# Altium schematic sheet VREF_DAC.SchDoc
size OrCAD B; SheetNumber: 8; SheetTotal: 11
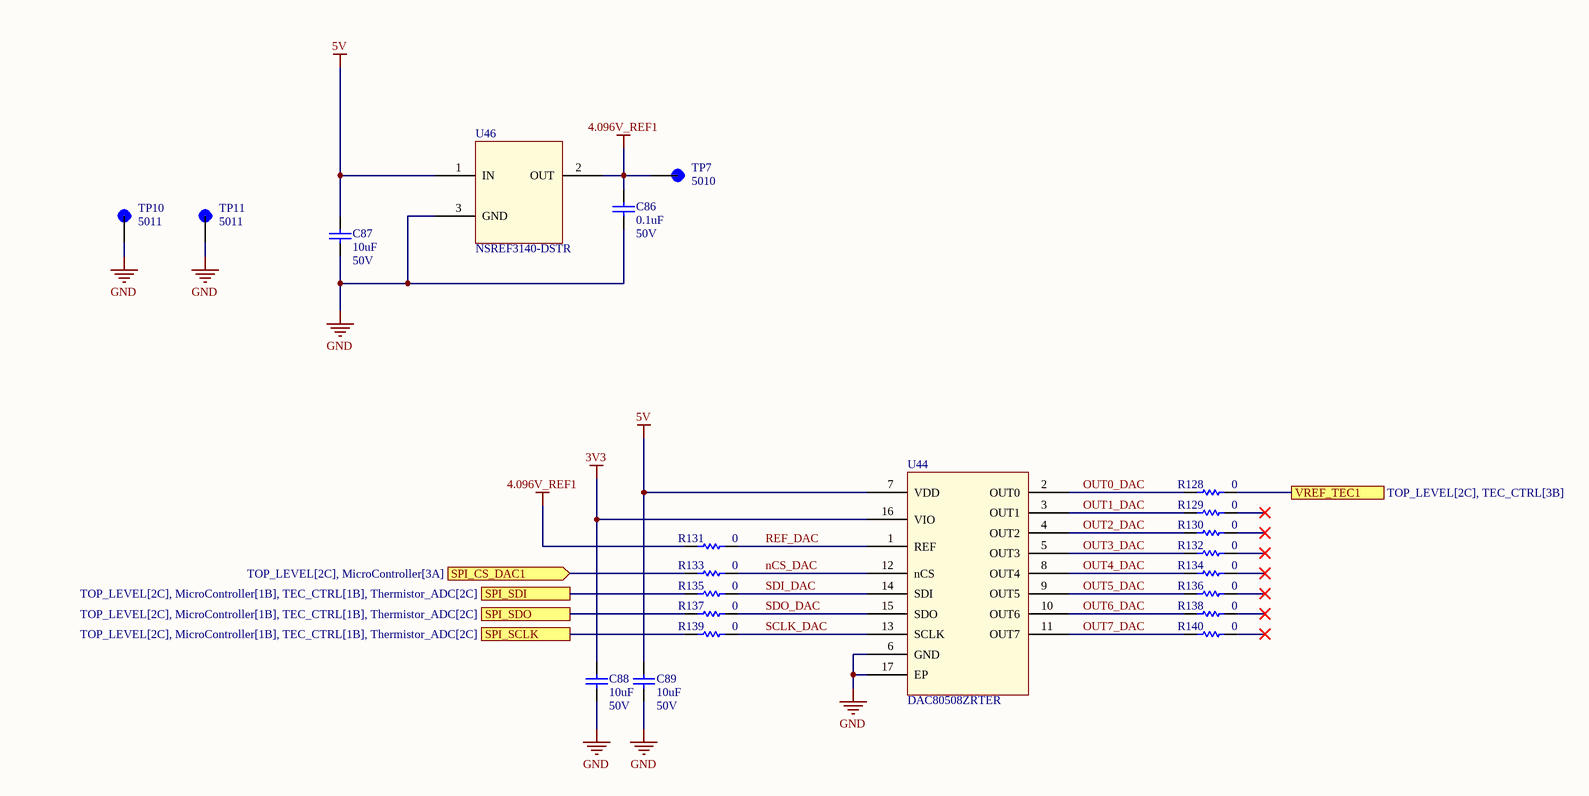
[diagram p0: VREF_DAC.SchDoc]

## Parts
C86  value 0.1uF  Rating: 50V  [DEFAULT_CAPACITOR_0805]  (hidden comment: KGM21NR71H104KT)
C87  value 10uF  Rating: 50V  [DEFAULT_CAPACITOR_0805]  (hidden comment: GRM21BR61H106KE43L)
C88  value 10uF  Rating: 50V  [DEFAULT_CAPACITOR_0805]  (hidden comment: GRM21BR61H106KE43L)
C89  value 10uF  Rating: 50V  [DEFAULT_CAPACITOR_0805]  (hidden comment: GRM21BR61H106KE43L)
R128  value 0  [DEFAULT_RESISTOR_0805]  (hidden comment: RC0805JR-070RL)
R129  value 0  [DEFAULT_RESISTOR_0805]  (hidden comment: RC0805JR-070RL)
R130  value 0  [DEFAULT_RESISTOR_0805]  (hidden comment: RC0805JR-070RL)
R131  value 0  [DEFAULT_RESISTOR_0805]  (hidden comment: RC0805JR-070RL)
R132  value 0  [DEFAULT_RESISTOR_0805]  (hidden comment: RC0805JR-070RL)
R133  value 0  [DEFAULT_RESISTOR_0805]  (hidden comment: RC0805JR-070RL)
R134  value 0  [DEFAULT_RESISTOR_0805]  (hidden comment: RC0805JR-070RL)
R135  value 0  [DEFAULT_RESISTOR_0805]  (hidden comment: RC0805JR-070RL)
R136  value 0  [DEFAULT_RESISTOR_0805]  (hidden comment: RC0805JR-070RL)
R137  value 0  [DEFAULT_RESISTOR_0805]  (hidden comment: RC0805JR-070RL)
R138  value 0  [DEFAULT_RESISTOR_0805]  (hidden comment: RC0805JR-070RL)
R139  value 0  [DEFAULT_RESISTOR_0805]  (hidden comment: RC0805JR-070RL)
R140  value 0  [DEFAULT_RESISTOR_0805]  (hidden comment: RC0805JR-070RL)
TP7  5010  [TP_5011]
TP10  5011  [TP_5011]
TP11  5011  [TP_5011]
U44  DAC80508ZRTER  [DAC80508ZRTER-WQFN16]
U46  NSREF3140-DSTR  [NSREF3140DSTR-SOT23-3L]

## Ports
SPI_CS_DAC1 (in, see TOP_LEVEL[2C], MicroController[3A]), SPI_SCLK (see TOP_LEVEL[2C], MicroController[1B], TEC_CTRL[1B], Thermistor_ADC[2C]), SPI_SDI (see TOP_LEVEL[2C], MicroController[1B], TEC_CTRL[1B], Thermistor_ADC[2C]), SPI_SDO (see TOP_LEVEL[2C], MicroController[1B], TEC_CTRL[1B], Thermistor_ADC[2C]), VREF_TEC1 (see TOP_LEVEL[2C], TEC_CTRL[3B])

## Nets
3V3: C88.2 U44.16(VIO)
4.096V_REF1: C86.2 R131.2 TP7.TP U46.2(OUT)
5V: C87.2 C89.2 U44.7(VDD) U46.1(IN)
GND: C86.1 C87.1 C88.1 C89.1 TP10.TP TP11.TP U44.6(GND) U44.17(EP) U46.3(GND)
nCS_DAC: R133.1 U44.12(nCS)
OUT0_DAC: R128.2 U44.2(OUT0)
OUT1_DAC: R129.2 U44.3(OUT1)
OUT2_DAC: R130.2 U44.4(OUT2)
OUT3_DAC: R132.2 U44.5(OUT3)
OUT4_DAC: R134.2 U44.8(OUT4)
OUT5_DAC: R136.2 U44.9(OUT5)
OUT6_DAC: R138.2 U44.10(OUT6)
OUT7_DAC: R140.2 U44.11(OUT7)
REF_DAC: R131.1 U44.1(REF)
SCLK_DAC: R139.1 U44.13(SCLK)
SDI_DAC: R135.1 U44.14(SDI)
SDO_DAC: R137.1 U44.15(SDO)
SPI_CS_DAC1: R133.2 ; port SPI_CS_DAC1
SPI_SCLK: R139.2 ; port SPI_SCLK
SPI_SDI: R135.2 ; port SPI_SDI
SPI_SDO: R137.2 ; port SPI_SDO
VREF_TEC1: R128.1 ; port VREF_TEC1

Not connected (* = marked no-connect by the designer): R129 1*; R130 1*; R132 1*; R134 1*; R136 1*; R138 1*; R140 1*

## Library data of the parts
C86 = KGM21NR71H104KT: CAP CER 0.1UF 50V X7R 0805; Manufacturer: Cal-Chip Electronics, Inc.; Manufacturer P/N: GMC55X7R226M50NT; MFR PN: KGM21NR71H104KT
C87-C89 = GRM21BR61H106KE43L: CAP CER 10UF 50V X5R 0805; MFR PN: GRM21BR61H106KE43L
R128-R140 = RC0805JR-070RL: RES 0 OHM JUMPER 1/8W 0805; Power: 1/8W; MFR PN: RC0805JR-070RL; Tolerance: *
TP7 = 5010: PC TEST POINT MULTIPURPOSE RED; MFR PN: 5010
TP10 TP11 = 5011: PC TEST POINT MULTIPURPOSE BLACK; MF: Keystone Electronics Corp.; SnapEDA_Link: https://www.snapeda.com/parts/5011/Keystone/view-part/?ref=snap; Package: None; Value: *; MP: 5011; Check_prices: https://www.snapeda.com/parts/5011/Keystone/view-part/?ref=eda; MFR PN: 5011
U44 = DAC80508ZRTER: IC DAC 16BIT V-OUT 16WQFN; Manufacturer: Texas Instruments; Manufacturer P/N: DAC80508ZRTER; MFR PN: DAC80508ZRTER
U46 = NSREF3140-DSTR: 0.2% ACCURACY 15PPM 4V REF; Manufacturer: NOVOSENSE; Manufacturer P/N: NSREF3140-DSTR; MFR PN: NSREF3140-DSTR